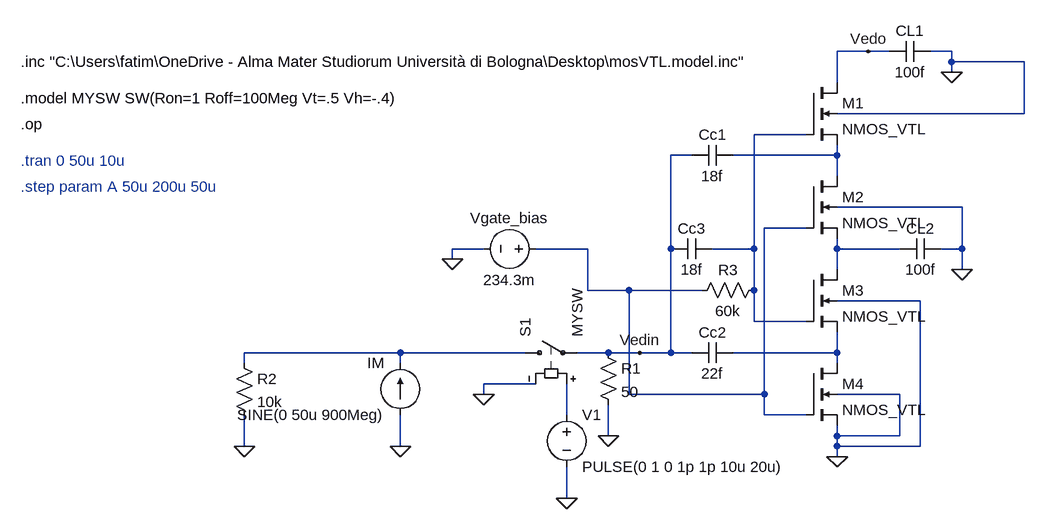
[diagram p0: schematic progetto2.asc]
progetto2.asc, the LTspice schematic file:
Version 4
SHEET 1 880 1044
WIRE 432 256 384 256
WIRE 464 256 432 256
WIRE 560 256 528 256
WIRE 560 272 560 256
WIRE 672 272 560 272
WIRE 560 288 560 272
WIRE 384 304 384 256
WIRE 672 352 672 272
WIRE 672 352 384 352
WIRE 336 384 256 384
WIRE 160 416 128 416
WIRE 384 416 384 400
WIRE 384 416 224 416
WIRE 384 448 384 416
WIRE 576 496 384 496
WIRE 336 528 272 528
WIRE -160 560 -208 560
WIRE 0 560 -80 560
WIRE 128 560 128 416
WIRE 256 560 256 384
WIRE 256 560 192 560
WIRE 384 560 384 544
WIRE 480 560 384 560
WIRE 576 560 576 496
WIRE 576 560 544 560
WIRE -208 576 -208 560
WIRE 384 592 384 560
WIRE 576 592 576 560
WIRE 0 624 0 560
WIRE 64 624 0 624
WIRE 176 624 64 624
WIRE 256 624 256 560
WIRE 512 640 384 640
WIRE 256 672 256 624
WIRE 336 672 256 672
WIRE -288 720 -528 720
WIRE -96 720 -288 720
WIRE 32 720 -16 720
WIRE 80 720 32 720
WIRE 128 720 128 560
WIRE 128 720 80 720
WIRE 160 720 128 720
WIRE 384 720 384 688
WIRE 384 720 224 720
WIRE -528 736 -528 720
WIRE -288 736 -288 720
WIRE 384 736 384 720
WIRE -80 768 -160 768
WIRE -160 784 -160 768
WIRE 64 784 64 624
WIRE 272 784 272 528
WIRE 272 784 64 784
WIRE 480 784 384 784
WIRE -32 816 -32 768
WIRE 272 816 272 784
WIRE 336 816 272 816
WIRE 32 848 32 800
WIRE 384 848 384 832
WIRE 480 848 480 784
WIRE 480 848 384 848
WIRE -528 864 -528 816
WIRE -288 864 -288 816
WIRE 384 864 384 848
WIRE 512 864 512 640
WIRE 512 864 384 864
WIRE 384 880 384 864
WIRE -32 944 -32 896
FLAG 384 880 0
FLAG 560 288 0
FLAG 576 592 0
FLAG -528 864 0
FLAG -288 864 0
FLAG 32 848 0
FLAG -160 784 0
FLAG -32 944 0
FLAG -208 576 0
FLAG 80 720 Vedin
FLAG 432 256 Vedo
SYMBOL nmos4 336 304 R0
SYMATTR InstName M1
SYMATTR Value NMOS_VTL
SYMATTR Value2 l=50n w=90n
SYMBOL nmos4 336 448 R0
SYMATTR InstName M2
SYMATTR Value NMOS_VTL
SYMATTR Value2 l=50n w=90n
SYMBOL nmos4 336 592 R0
SYMATTR InstName M3
SYMATTR Value NMOS_VTL
SYMATTR Value2 l=50n w=90n
SYMBOL nmos4 336 736 R0
SYMATTR InstName M4
SYMATTR Value NMOS_VTL
SYMATTR Value2 l=50n w=90n
SYMBOL cap 528 240 R90
WINDOW 0 0 32 VBottom 2
WINDOW 3 32 32 VTop 2
SYMATTR InstName CL1
SYMATTR Value 100f
SYMBOL cap 544 544 R90
WINDOW 0 0 32 VBottom 2
WINDOW 3 32 32 VTop 2
SYMATTR InstName CL2
SYMATTR Value 100f
SYMBOL cap 224 400 R90
WINDOW 0 0 32 VBottom 2
WINDOW 3 32 32 VTop 2
SYMATTR InstName Cc1
SYMATTR Value 18f
SYMBOL cap 224 704 R90
WINDOW 0 0 32 VBottom 2
WINDOW 3 32 32 VTop 2
SYMATTR InstName Cc2
SYMATTR Value 22f
SYMBOL current -288 816 R180
WINDOW 0 24 80 Left 2
WINDOW 3 24 0 Left 2
WINDOW 123 0 0 Left 0
WINDOW 39 0 0 Left 0
SYMATTR InstName IM
SYMATTR Value SINE(0 50u 900Meg)
SYMBOL res 16 704 R0
SYMATTR InstName R1
SYMATTR Value 50
SYMBOL res -544 720 R0
SYMATTR InstName R2
SYMATTR Value 10k
SYMBOL sw -112 720 R270
SYMATTR InstName S1
SYMATTR Value MYSW
SYMBOL voltage -32 800 R0
WINDOW 123 0 0 Left 0
WINDOW 39 0 0 Left 0
SYMATTR InstName V1
SYMATTR Value PULSE(0 1 0 1p 1p 10u 20u)
SYMBOL cap 192 544 R90
WINDOW 0 0 32 VBottom 2
WINDOW 3 32 32 VTop 2
SYMATTR InstName Cc3
SYMATTR Value 18f
SYMBOL res 272 608 R90
WINDOW 0 0 56 VBottom 2
WINDOW 3 32 56 VTop 2
SYMATTR InstName R3
SYMATTR Value 60k
SYMBOL voltage -64 560 R90
WINDOW 0 -32 56 VBottom 2
WINDOW 3 32 56 VTop 2
WINDOW 123 0 0 Left 0
WINDOW 39 0 0 Left 0
SYMATTR InstName Vgate_bias
SYMATTR Value 234.3m
TEXT -872 328 Left 2 !.model MYSW SW(Ron=1 Roff=100Meg Vt=.5 Vh=-.4)
TEXT -872 272 Left 2 !.inc "C:\\Users\\fatim\\OneDrive - Alma Mater Studiorum Università di Bologna\\Desktop\\mosVTL.model.inc"
TEXT -872 368 Left 2 !.op
TEXT -872 424 Left 2 ;.tran 0 50u 10u
TEXT -872 464 Left 2 ;.step param A 50u 200u 50u

The netlist it stands for:
* progetto2.asc
M1 Vedo N001 N002 0 NMOS_VTL l=50n w=90n
M2 N002 N003 N004 0 NMOS_VTL l=50n w=90n
M3 N004 N001 N006 0 NMOS_VTL l=50n w=90n
M4 N006 N003 0 0 NMOS_VTL l=50n w=90n
CL1 0 Vedo 100f
CL2 0 N004 100f
Cc1 N002 Vedin 18f
Cc2 N006 Vedin 22f
IM 0 N005 SINE(0 50u 900Meg)
R1 Vedin 0 50
R2 N005 0 10k
S1 N005 Vedin N007 0 MYSW
V1 N007 0 PULSE(0 1 0 1p 1p 10u 20u)
Cc3 N001 Vedin 18f
R3 N001 N003 60k
Vgate_bias N003 0 234.3m
.model NMOS NMOS
.model PMOS PMOS
.lib standard.mos
.model MYSW SW(Ron=1 Roff=100Meg Vt=.5 Vh=-.4)
.inc "C:\Users\fatim\OneDrive - Alma Mater Studiorum Università di Bologna\Desktop\mosVTL.model.inc"
.op
* .tran 0 50u 10u
* .step param A 50u 200u 50u
.backanno
.end